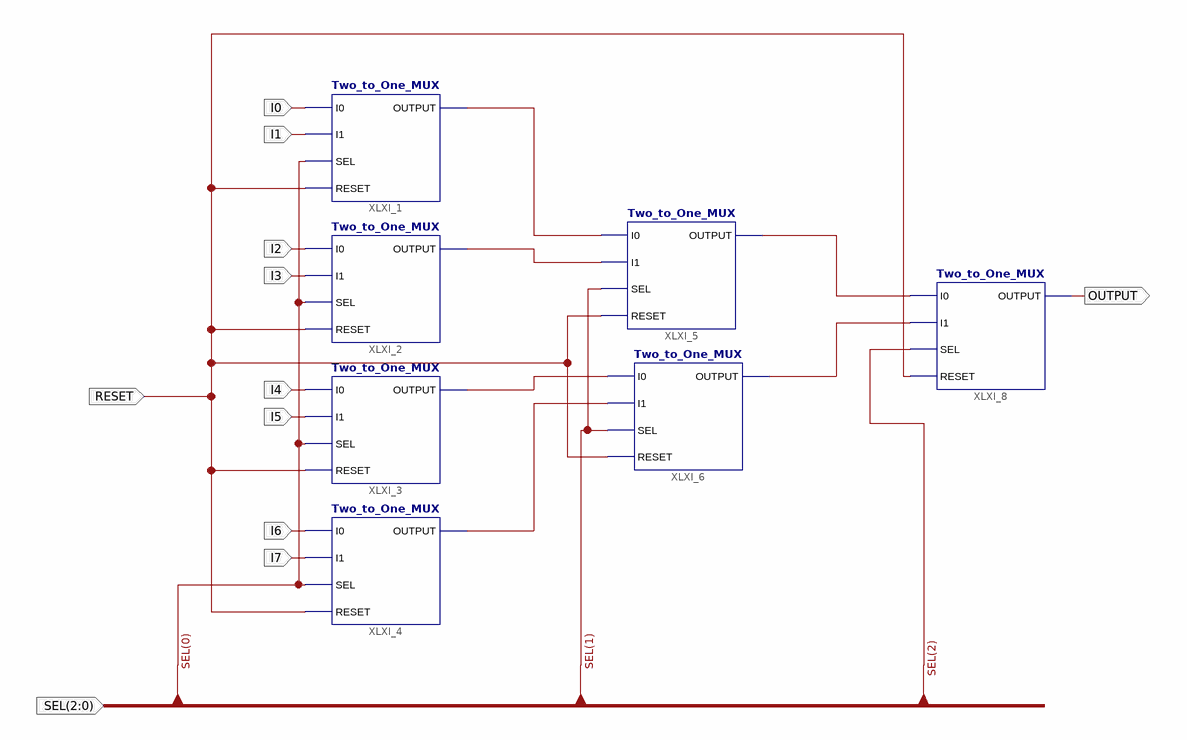
[diagram p0: schematic sheet 1]
// Xilinx ISE schematic Eight_to_One_MUX.sch (spartan6) as structural Verilog: 7 symbols, 11 ports
module Eight_to_One_MUX (
  input  [2:0] SEL,
  input  RESET,
  input  I0,
  input  I1,
  input  I2,
  input  I3,
  input  I4,
  input  I5,
  input  I6,
  input  I7,
  output OUTPUT
);

  wire XLXN_1, XLXN_2, XLXN_3, XLXN_4, XLXN_5, XLXN_6;

  Two_to_One_MUX XLXI_1 (.I0(I0), .I1(I1), .OUTPUT(XLXN_1), .RESET(RESET), .SEL(SEL[0]));
  Two_to_One_MUX XLXI_2 (.I0(I2), .I1(I3), .OUTPUT(XLXN_2), .RESET(RESET), .SEL(SEL[0]));
  Two_to_One_MUX XLXI_3 (.I0(I4), .I1(I5), .OUTPUT(XLXN_3), .RESET(RESET), .SEL(SEL[0]));
  Two_to_One_MUX XLXI_4 (.I0(I6), .I1(I7), .OUTPUT(XLXN_4), .RESET(RESET), .SEL(SEL[0]));
  Two_to_One_MUX XLXI_5 (.I0(XLXN_1), .I1(XLXN_2), .OUTPUT(XLXN_5), .RESET(RESET), .SEL(SEL[1]));
  Two_to_One_MUX XLXI_6 (.I0(XLXN_3), .I1(XLXN_4), .OUTPUT(XLXN_6), .RESET(RESET), .SEL(SEL[1]));
  Two_to_One_MUX XLXI_8 (.I0(XLXN_5), .I1(XLXN_6), .OUTPUT(OUTPUT), .RESET(RESET), .SEL(SEL[2]));
endmodule
